# EasyEDA schematic SWM341_DAPLink 2T45.json
TITLE: SWM341 DAPLink; REV: 1.0; Date: 2022-02-17; Sheet: 1/1; Drawn By: XIVN1987; Company: Synwit
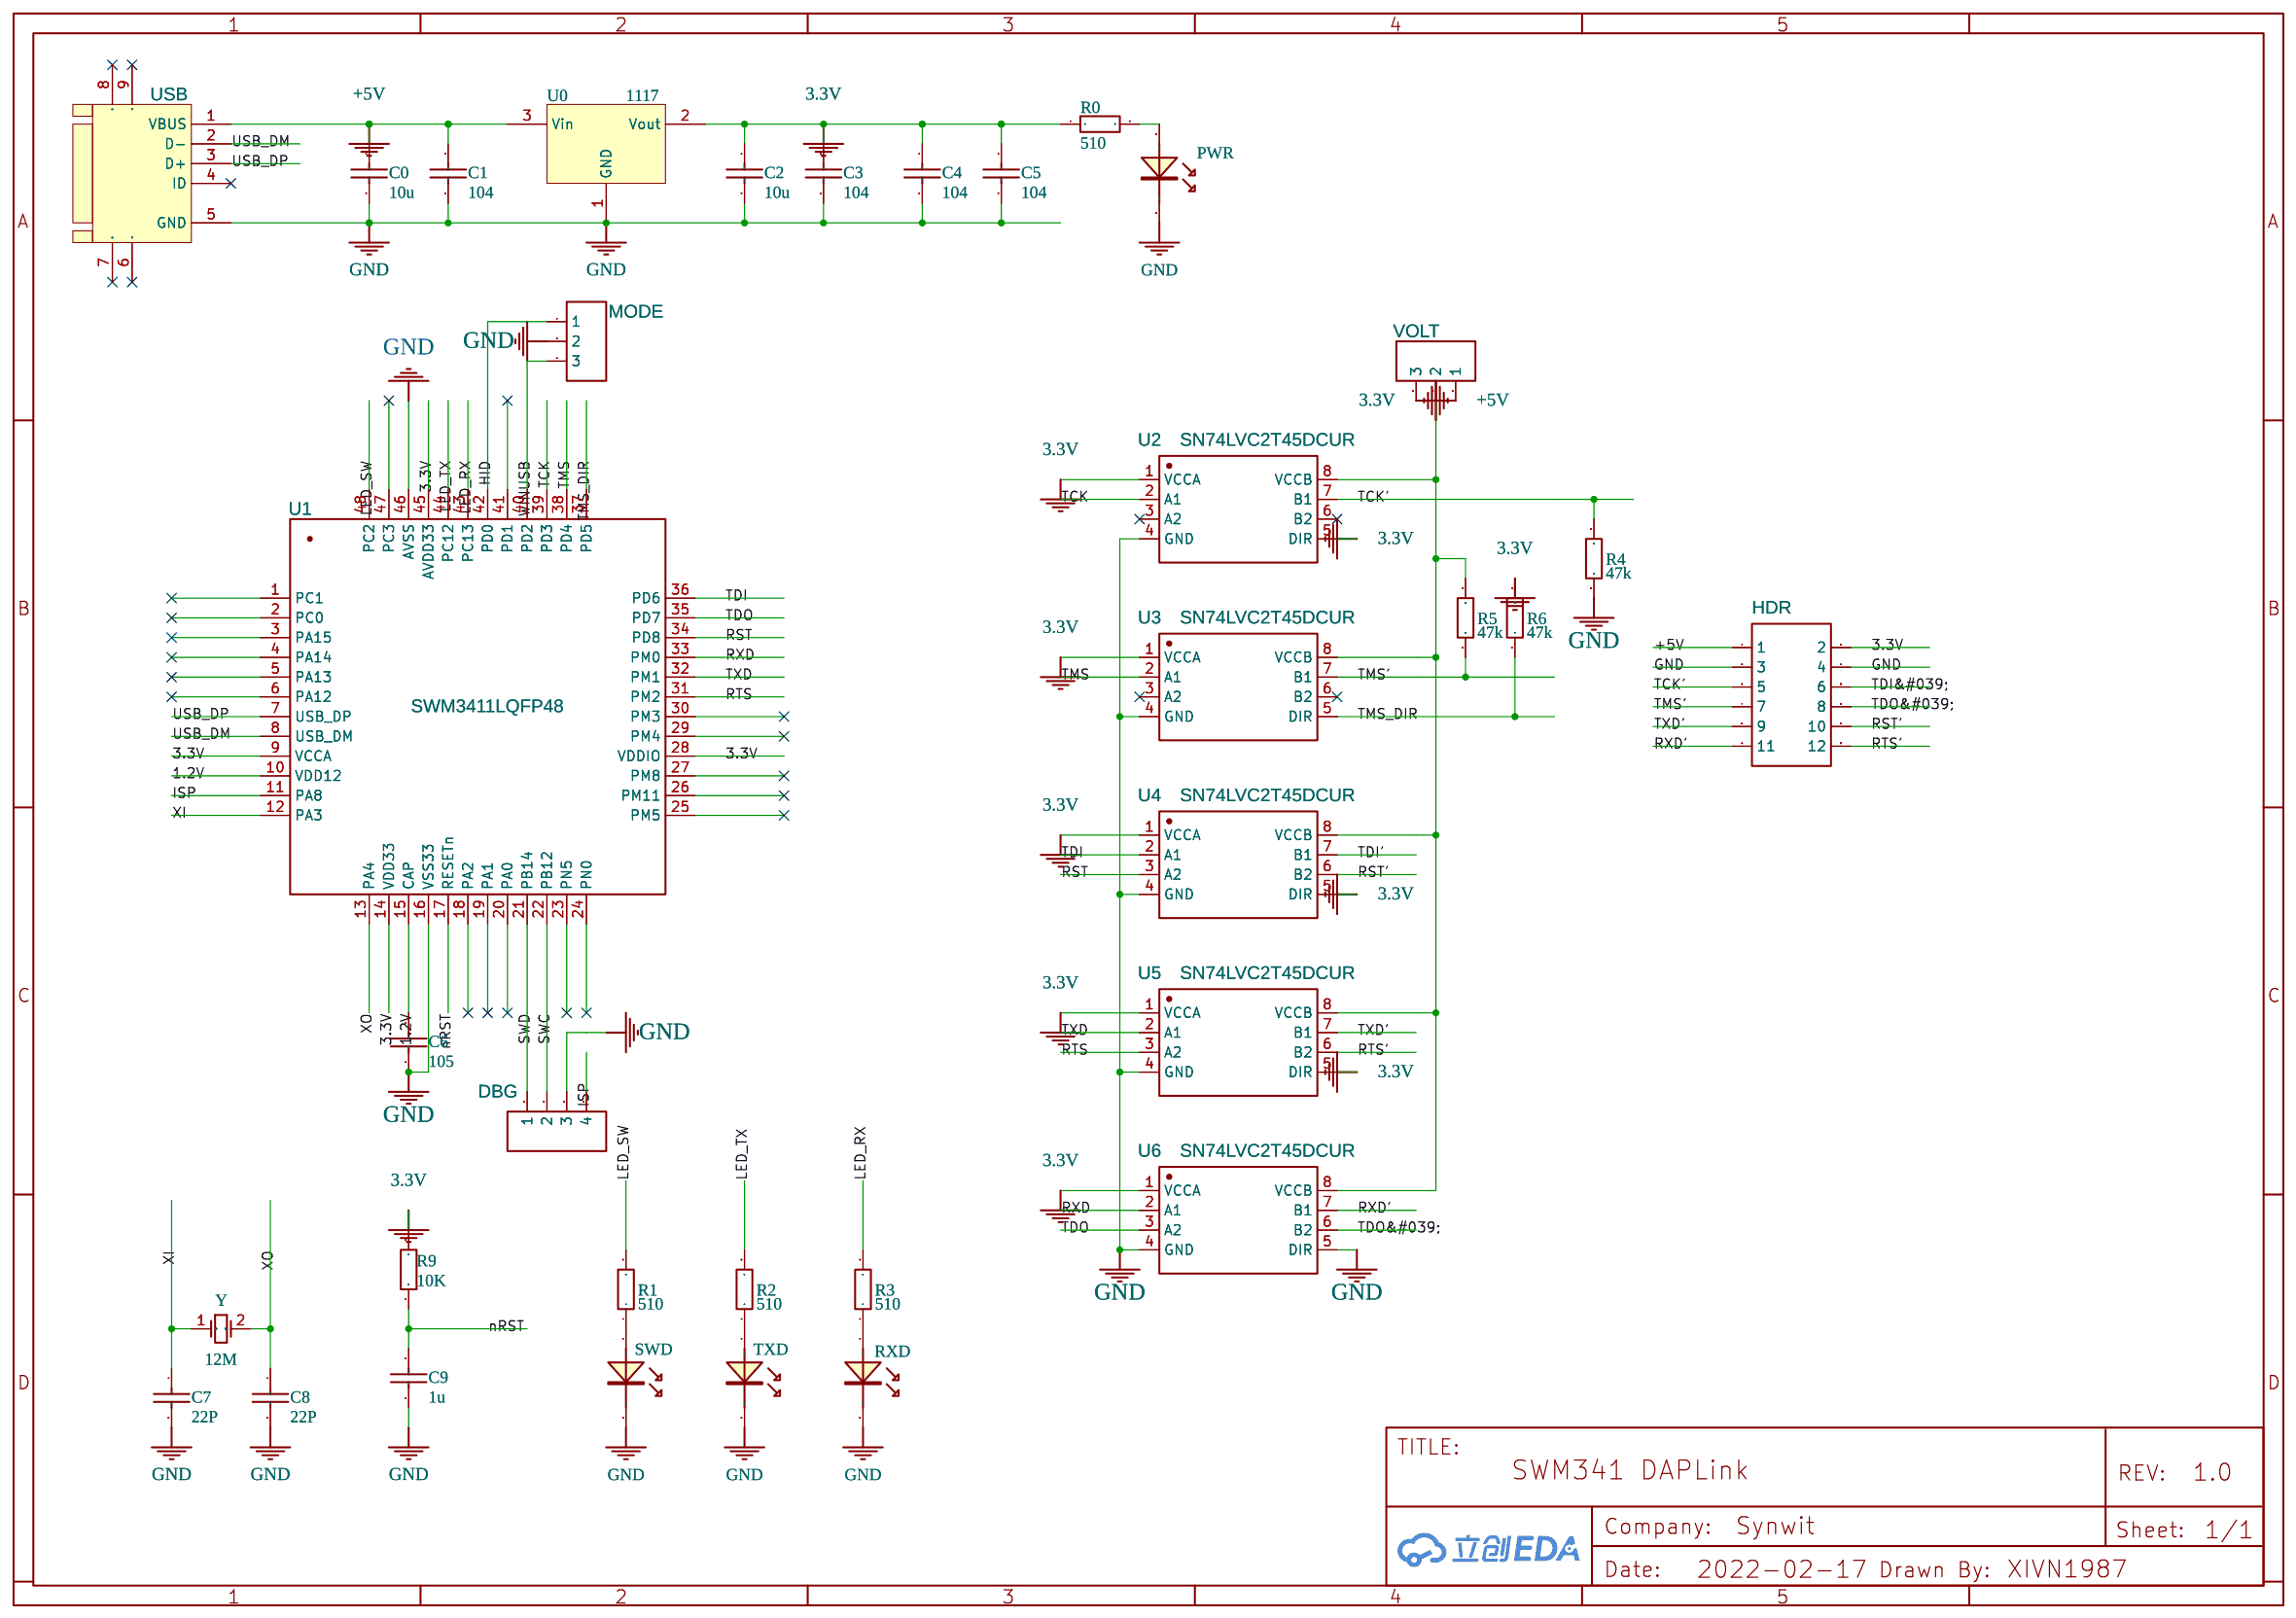
[diagram p0: schematic sheet]

## Parts
C0  10u  [C0805]
C1  104  [C0805]
C2  10u  [C0805]
C3  104  [C0805]
C4  104  [C0805]
C5  104  [C0805]
C6  105  [C0805]
C7  22P  [C0805]
C8  22P  [C0805]
C9  1u  [C0805]
DBG  HDR-M-2.54_1x4  [HDR-M-2.54_1X4]
HDR  HDR-M-2.54_2x6  [SMD-HDR6X2]
MODE  HDR-M-2.54_1x3  [HDR-M-2.54_1X3]
PWR  NO  [LED0805_RED]
R0  510  [R0805]
R1  510  [R0805]
R2  510  [R0805]
R3  510  [R0805]
R4  47k  [R0805]
R5  47k  [R0805]
R6  47k  [R0805]
R9  10K  [R0805]
RXD  NO  [LED0805_RED]
SWD  NO  [LED0805_RED]
TXD  NO  [LED0805_RED]
U0  1117  [SOT-223]
U1  SWM3411LQFP48  [LQFP48-0.5-7X7MM]
U2  SN74LVC2T45DCUR  [VSSOP-8_L2.4-W2.1-P0.50-LS3.2-BR]
U3  SN74LVC2T45DCUR  [VSSOP-8_L2.4-W2.1-P0.50-LS3.2-BR]
U4  SN74LVC2T45DCUR  [VSSOP-8_L2.4-W2.1-P0.50-LS3.2-BR]
U5  SN74LVC2T45DCUR  [VSSOP-8_L2.4-W2.1-P0.50-LS3.2-BR]
U6  SN74LVC2T45DCUR  [VSSOP-8_L2.4-W2.1-P0.50-LS3.2-BR]
USB  MicroUSB  [MICROUSB]
VOLT  HDR-M-2.54_1x3  [HDR-M-2.54_1X3]
Y  12M  [SMD-5032_2P]

## Library data of the parts
DBG = HDR-M-2.54_1x4: Supplier Part: C124378; Supplier: LCSC; Contributor: LCEDA_Lib
HDR = HDR-M-2.54_2x6: Supplier Part: C124388; Supplier: LCSC; Contributor: LCEDA_Lib
MODE VOLT = HDR-M-2.54_1x3: Supplier Part: C180248; Supplier: LCSC; Contributor: LCEDA_Lib
R9 = -: Published: 8-Jun-2000; LatestRevisionDate: 17-Jul-2002; LatestRevisionNote: Re-released for DXP Platform.; PackageReference: AXIAL-0.4; Publisher: Altium Limited; Comment: Res
U1 = SWM3411LQFP48: Contributor: XIVN1987
U2-U6 = SN74LVC2T45DCUR: Supplier: LCSC; Manufacturer: TI; Supplier Part: C15741; JLCPCB Part Class: Extended Part
USB = MicroUSB: Contributor: XIVN1987
Y = -: Published: 8-Jun-2000; LatestRevisionDate: 17-Jul-2002; LatestRevisionNote: Re-released for DXP Platform.; PackageReference: R38; Publisher: Altium Limited

## Nets
1.2V: C6.1 U1.10(VDD12) U1.15(CAP)
3.3V: C2.1 C3.1 C4.1 C5.1 HDR.2 R0.1 R6.2 R9.2 U0.2(Vout) U1.9(VCCA) U1.14(VDD33) U1.28(VDDIO) U1.45(AVDD33) U2.1(VCCA) U2.5(DIR) U3.1(VCCA) U4.1(VCCA) U4.5(DIR) U5.1(VCCA) U5.5(DIR) U6.1(VCCA) VOLT.3
+5V: C0.1 C1.1 HDR.1 U0.3(Vin) USB.1(VBUS) VOLT.1
GND: C0.2 C1.2 C2.2 C3.2 C4.2 C5.2 C6.2 C7.2 C8.2 C9.2 DBG.3 HDR.3 HDR.4 MODE.2 PWR.2(K) R4.1 RXD.2(K) SWD.2(K) TXD.2(K) U0.1(GND) U1.16(VSS33) U1.46(AVSS) U2.4(GND) U3.4(GND) U4.4(GND) U5.4(GND) U6.4(GND) U6.5(DIR) USB.5(GND)
HID: MODE.1 U1.42(PD0)
ISP: DBG.4 U1.11(PA8)
LED_RX: R3.2 U1.43(PC13)
LED_SW: R1.2 U1.48(PC2)
LED_TX: R2.2 U1.44(PC12)
nRST: C9.1 R9.1 U1.17(RESETn)
RST: U1.34(PD8) U4.3(A2)
RST': HDR.10 U4.6(B2)
RTS: U1.31(PM2) U5.3(A2)
RTS': HDR.12 U5.6(B2)
RXD: U1.33(PM0) U6.2(A1)
RXD': HDR.11 U6.7(B1)
SWC: DBG.2 U1.22(PB12)
SWD: DBG.1 U1.21(PB14)
TCK: U1.39(PD3) U2.2(A1)
TCK': HDR.5 R4.2 U2.7(B1)
TDI: U1.36(PD6) U4.2(A1)
TDI&#039;: HDR.6
TDI': U4.7(B1)
TDO: U1.35(PD7) U6.3(A2)
TDO&#039;: HDR.8 U6.6(B2)
TMS: U1.38(PD4) U3.2(A1)
TMS': HDR.7 R5.1 U3.7(B1)
TMS_DIR: R6.1 U1.37(PD5) U3.5(DIR)
TXD: U1.32(PM1) U5.2(A1)
TXD': HDR.9 U5.7(B1)
USB_DM: U1.8(USB_DM) USB.2(D-)
USB_DP: U1.7(USB_DP) USB.3(D+)
WINUSB: MODE.3 U1.40(PD2)
XI: C7.1 U1.12(PA3) Y.1(OSC1)
XO: C8.1 U1.13(PA4) Y.2(OSC2)
Net-(PWR-1): PWR.1(A) R0.2
Net-(R1-1): R1.1 SWD.1(A)
Net-(R2-1): R2.1 TXD.1(A)
Net-(R3-1): R3.1 RXD.1(A)
Net-(R5-2): R5.2 U2.8(VCCB) U3.8(VCCB) U4.8(VCCB) U5.8(VCCB) U6.8(VCCB) VOLT.2

Not connected (* = marked no-connect by the designer): U1 1(PC1) 2(PC0) 3(PA15) 4(PA14) 5(PA13) 6(PA12) 18(PA2) 19(PA1) 20(PA0) 23(PN5) 24(PN0) 25(PM5) 26(PM11) 27(PM8) 29(PM4) 30(PM3) 41(PD1) 47(PC3); U2 3(A2)* 6(B2)*; U3 3(A2)* 6(B2)*; USB 4(ID)* 6(NC)* 7(NC)* 8(NC)* 9(NC)*
